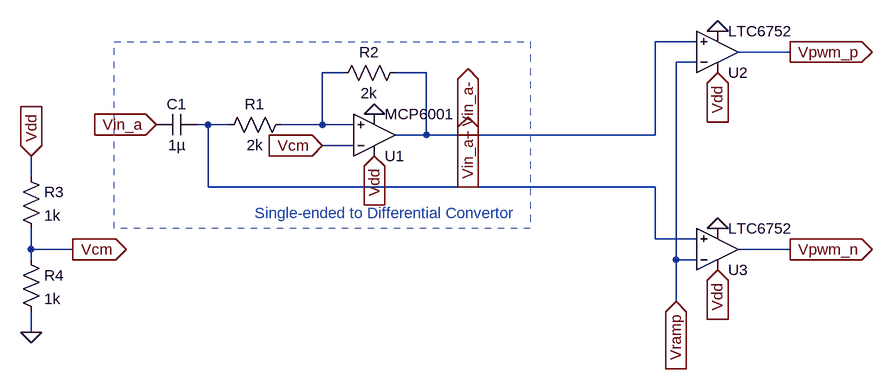
[diagram p0: schematic Draft19.asc]
Draft19.asc, the LTspice schematic file:
Version 4
SHEET 1 880 680
WIRE 416 -64 352 -64
WIRE 560 -48 480 -48
WIRE 416 -32 384 -32
WIRE -128 -16 -160 -16
WIRE 0 -16 -48 -16
WIRE -336 64 -352 64
WIRE -304 64 -336 64
WIRE -160 64 -160 -16
WIRE -160 64 -224 64
WIRE -112 64 -160 64
WIRE 0 80 0 -16
WIRE 0 80 -48 80
WIRE 64 80 0 80
WIRE 352 80 352 -64
WIRE 352 80 64 80
WIRE -112 96 -160 96
WIRE -608 144 -608 112
WIRE -336 160 -336 64
WIRE 64 160 -336 160
WIRE 352 160 64 160
WIRE 352 240 352 160
WIRE 416 240 352 240
WIRE -608 256 -608 224
WIRE -544 256 -608 256
WIRE 560 256 480 256
WIRE -608 272 -608 256
WIRE 384 272 384 -32
WIRE 416 272 384 272
WIRE 384 336 384 272
WIRE -608 384 -608 352
FLAG -160 96 Vcm
IOPIN -160 96 In
FLAG -416 64 Vin_a
IOPIN -416 64 In
FLAG 64 80 Vin_a-
IOPIN 64 80 Out
FLAG 64 160 Vin_a+
IOPIN 64 160 Out
FLAG 560 -48 Vpwm_p
IOPIN 560 -48 Out
FLAG 560 256 Vpwm_n
IOPIN 560 256 Out
FLAG 448 -16 Vdd
IOPIN 448 -16 In
FLAG 448 288 Vdd
IOPIN 448 288 In
FLAG 448 224 0
FLAG 448 -80 0
FLAG -80 48 0
FLAG -80 112 Vdd
IOPIN -80 112 In
FLAG -608 384 0
FLAG -544 256 Vcm
IOPIN -544 256 Out
FLAG -608 112 Vdd
IOPIN -608 112 In
FLAG 384 336 Vramp
IOPIN 384 336 In
SYMBOL cap -352 48 R90
WINDOW 0 0 32 VBottom 2
WINDOW 3 32 32 VTop 2
SYMATTR InstName C1
SYMATTR Value 1µ
SYMBOL res -208 48 R90
WINDOW 0 0 56 VBottom 2
WINDOW 3 32 56 VTop 2
SYMATTR InstName R1
SYMATTR Value 2k
SYMBOL res -32 -32 R90
WINDOW 0 0 56 VBottom 2
WINDOW 3 32 56 VTop 2
SYMATTR InstName R2
SYMATTR Value 2k
SYMBOL MCP6001 -80 80 M180
SYMATTR InstName U1
SYMBOL Comparators\\LTC6752 448 16 M180
SYMATTR InstName U2
SYMBOL Comparators\\LTC6752 448 320 M180
SYMATTR InstName U3
SYMBOL res -624 128 R0
SYMATTR InstName R3
SYMATTR Value 1k
SYMBOL res -624 256 R0
SYMATTR InstName R4
SYMATTR Value 1k
TEXT -264 200 Left 2 ;Single-ended to Differential Convertor
RECTANGLE Normal 160 224 -480 -64 2

The netlist it stands for:
* Draft19.asc
C1 Vin_a+ Vin_a 1µ
R1 N001 Vin_a+ 2k
R2 Vin_a- N001 2k
* U1: MCP6001 (symbol MCP6001 not available, pins judged from their places): In+=N001 In-=Vcm V+=Vdd V-=0 OUT=Vin_a-
XU2 Vin_a- Vramp Vdd 0 Vpwm_p LTC6752  ; pins In+ In- V+ V- OUT
XU3 Vin_a+ Vramp Vdd 0 Vpwm_n LTC6752  ; pins In+ In- V+ V- OUT
R3 Vdd Vcm 1k
R4 Vcm 0 1k
* Single-ended to Differential Convertor
.lib LTC7.lib
.backanno
.end